# Altium schematic sheet FrameWork.SchDoc
size A4
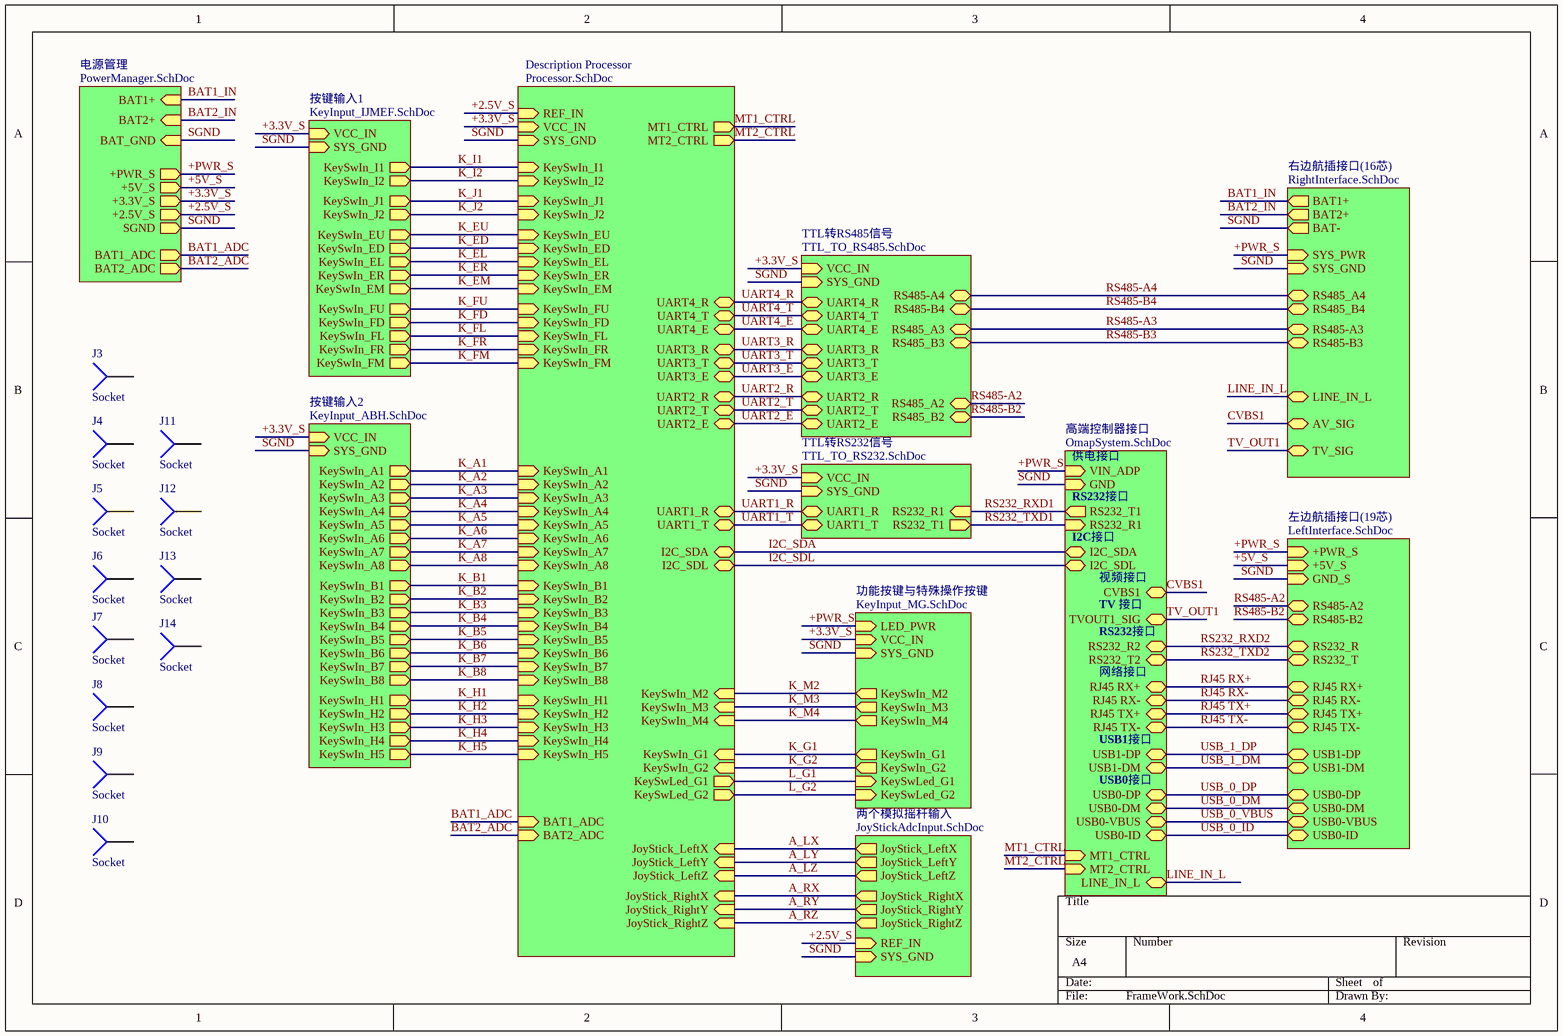
[diagram p0: FrameWork.SchDoc]

## Parts
J3  Socket  [HT-M3]
J4  Socket  [HT-M3]
J5  Socket  [HT-M3]
J6  Socket  [HT-M3]
J7  Socket  [HT-M3]
J8  Socket  [HT-M3]
J9  Socket  [HT-M3]
J10  Socket  [HT-M3]
J11  Socket  [HT-M3]
J12  Socket  [HT-M3]
J13  Socket  [HT-M3]
J14  Socket  [HT-M3]

## Sub-sheets
Description Processor = Processor.SchDoc: KeySwIn_I1 (in), KeySwIn_I2 (in), KeySwIn_J1 (in), KeySwIn_J2 (in), KeySwIn_EU (in), KeySwIn_ED (in), KeySwIn_EL (in), KeySwIn_ER (in), KeySwIn_EM (in), KeySwIn_FU (in), KeySwIn_FD (in), KeySwIn_FL (in), KeySwIn_FR (in), KeySwIn_FM (in), KeySwIn_A2 (in), KeySwIn_A3 (in), KeySwIn_A4 (in), KeySwIn_A5 (in), KeySwIn_A6 (in), KeySwIn_A7 (in), KeySwIn_A8 (in), KeySwIn_A1 (in), KeySwIn_B2 (in), KeySwIn_B3 (in), KeySwIn_B4 (in), KeySwIn_B5 (in), KeySwIn_B6 (in), KeySwIn_B7 (in), KeySwIn_B8 (in), KeySwIn_B1 (in), KeySwIn_H2 (in), KeySwIn_H3 (in), KeySwIn_H4 (in), KeySwIn_H5 (in), KeySwIn_H1 (in), KeySwIn_M3 (in), KeySwIn_M4 (in), KeySwIn_M2 (in), KeySwIn_G1 (in), KeySwIn_G2 (in), JoyStick_LeftX (in), JoyStick_LeftY (in), JoyStick_LeftZ (in), JoyStick_RightX (in), JoyStick_RightY (in), JoyStick_RightZ (in), KeySwLed_G1 (out), VCC_IN (in), SYS_GND (in), REF_IN (in), I2C_SDL (bidir), I2C_SDA (bidir), UART1_T (bidir), UART1_R (bidir), UART3_T (bidir), UART3_R (bidir), UART3_E (bidir), UART2_T (bidir), UART2_R (bidir), UART4_T (bidir), UART4_R (bidir), UART4_E (bidir), UART2_E (bidir), BAT2_ADC (in), BAT1_ADC (in), MT1_CTRL (out), MT2_CTRL (out), KeySwLed_G2 (out)
TTL转RS232信号 = TTL_TO_RS232.SchDoc: RS232_R1 (in), VCC_IN (in), SYS_GND (in), UART1_T (bidir), UART1_R (bidir), RS232_T1 (out)
TTL转RS485信号 = TTL_TO_RS485.SchDoc: VCC_IN (in), SYS_GND (in), UART3_T (bidir), UART3_R (bidir), RS485_B3 (bidir), RS485_A3 (bidir), RS485-B4 (bidir), RS485-A4 (bidir), UART3_E (bidir), UART2_T (bidir), UART2_R (bidir), UART4_T (bidir), UART4_R (bidir), UART4_E (bidir), UART2_E (bidir), RS485_B2 (bidir), RS485_A2 (bidir)
两个模拟摇杆输入 = JoyStickAdcInput.SchDoc: JoyStick_LeftX (out), JoyStick_LeftY (out), JoyStick_LeftZ (out), JoyStick_RightX (out), JoyStick_RightY (out), JoyStick_RightZ (out), REF_IN (in), SYS_GND (in)
功能按键与特殊操作按键 = KeyInput_MG.SchDoc: KeySwIn_M2 (out), KeySwIn_M3 (out), KeySwIn_M4 (out), KeySwIn_G2 (out), KeySwLed_G1 (in), KeySwIn_G1 (out), VCC_IN (in), SYS_GND (in), LED_PWR (in), KeySwLed_G2 (in)
右边航插接口(16芯) = RightInterface.SchDoc: RS485_B4 (bidir), RS485_A4 (bidir), BAT- (out), BAT1+ (out), SYS_GND (in), SYS_PWR (in), RS485-B3 (bidir), RS485-A3 (bidir), AV_SIG (bidir), TV_SIG (bidir), LINE_IN_L (bidir), BAT2+ (out)
左边航插接口(19芯) = LeftInterface.SchDoc: USB1-DP (bidir), USB1-DM (bidir), USB0-DP (bidir), USB0-DM (bidir), USB0-VBUS (bidir), USB0-ID (bidir), RS232_T (bidir), RS232_R (bidir), RS485-B2 (bidir), RS485-A2 (bidir), RJ45 RX+ (bidir), RJ45 TX+ (bidir), RJ45 RX- (bidir), RJ45 TX- (bidir), +PWR_S (in), +5V_S (in), GND_S (in)
按键输入1 = KeyInput_IJMEF.SchDoc: KeySwIn_I1 (out), KeySwIn_I2 (out), KeySwIn_J1 (out), KeySwIn_J2 (out), KeySwIn_EU (out), KeySwIn_ED (out), KeySwIn_EL (out), KeySwIn_ER (out), KeySwIn_EM (out), KeySwIn_FU (out), KeySwIn_FD (out), KeySwIn_FL (out), KeySwIn_FR (out), KeySwIn_FM (out), VCC_IN (in), SYS_GND (in)
按键输入2 = KeyInput_ABH.SchDoc: KeySwIn_A1 (out), KeySwIn_A2 (out), KeySwIn_A3 (out), KeySwIn_A4 (out), KeySwIn_A5 (out), KeySwIn_A6 (out), KeySwIn_A7 (out), KeySwIn_A8 (out), KeySwIn_B1 (out), KeySwIn_B2 (out), KeySwIn_B3 (out), KeySwIn_B4 (out), KeySwIn_B5 (out), KeySwIn_B6 (out), KeySwIn_B7 (out), KeySwIn_B8 (out), KeySwIn_H1 (out), KeySwIn_H2 (out), KeySwIn_H3 (out), KeySwIn_H4 (out), KeySwIn_H5 (out), VCC_IN (in), SYS_GND (in)
电源管理 = PowerManager.SchDoc: +PWR_S (out), +5V_S (out), +3.3V_S (out), +2.5V_S (out), BAT1+ (in), BAT2+ (in), SGND (out), BAT2_ADC (out), BAT1_ADC (out), BAT_GND (in)
高端控制器接口 = OmapSystem.SchDoc: VIN_ADP (in), GND (in), RJ45 RX+ (bidir), RJ45 TX+ (bidir), RJ45 RX- (bidir), RJ45 TX- (bidir), I2C_SDL (bidir), I2C_SDA (bidir), USB1-DP (bidir), USB1-DM (bidir), USB0-DP (bidir), USB0-DM (bidir), USB0-VBUS (bidir), USB0-ID (bidir), RS232_T2 (bidir), RS232_R2 (bidir), RS232_T1 (out), RS232_R1 (in), CVBS1 (bidir), TVOUT1_SIG (bidir), MT1_CTRL (in), MT2_CTRL (in), LINE_IN_L (bidir)

## Nets
+2.5V_S: sheet Description Processor/REF_IN, sheet 两个模拟摇杆输入/REF_IN, sheet 电源管理/+2.5V_S
+3.3V_S: sheet Description Processor/VCC_IN, sheet 按键输入1/VCC_IN, sheet 按键输入2/VCC_IN, sheet 功能按键与特殊操作按键/VCC_IN, sheet 电源管理/+3.3V_S, sheet TTL转RS232信号/VCC_IN, sheet TTL转RS485信号/VCC_IN
+5V_S: sheet 电源管理/+5V_S, sheet 左边航插接口(19芯)/+5V_S
+PWR_S: sheet 高端控制器接口/VIN_ADP, sheet 功能按键与特殊操作按键/LED_PWR, sheet 右边航插接口(16芯)/SYS_PWR, sheet 电源管理/+PWR_S, sheet 左边航插接口(19芯)/+PWR_S
A_LX: sheet Description Processor/JoyStick_LeftX, sheet 两个模拟摇杆输入/JoyStick_LeftX
A_LY: sheet Description Processor/JoyStick_LeftY, sheet 两个模拟摇杆输入/JoyStick_LeftY
A_LZ: sheet Description Processor/JoyStick_LeftZ, sheet 两个模拟摇杆输入/JoyStick_LeftZ
A_RX: sheet Description Processor/JoyStick_RightX, sheet 两个模拟摇杆输入/JoyStick_RightX
A_RY: sheet Description Processor/JoyStick_RightY, sheet 两个模拟摇杆输入/JoyStick_RightY
A_RZ: sheet Description Processor/JoyStick_RightZ, sheet 两个模拟摇杆输入/JoyStick_RightZ
BAT1_ADC: sheet Description Processor/BAT1_ADC, sheet 电源管理/BAT1_ADC
BAT1_IN: sheet 右边航插接口(16芯)/BAT1+, sheet 电源管理/BAT1+
BAT2_ADC: sheet Description Processor/BAT2_ADC, sheet 电源管理/BAT2_ADC
BAT2_IN: sheet 右边航插接口(16芯)/BAT2+, sheet 电源管理/BAT2+
CVBS1: sheet 高端控制器接口/CVBS1, sheet 右边航插接口(16芯)/AV_SIG
I2C_SDA: sheet Description Processor/I2C_SDA, sheet 高端控制器接口/I2C_SDA
I2C_SDL: sheet Description Processor/I2C_SDL, sheet 高端控制器接口/I2C_SDL
K_A1: sheet Description Processor/KeySwIn_A1, sheet 按键输入2/KeySwIn_A1
K_A2: sheet Description Processor/KeySwIn_A2, sheet 按键输入2/KeySwIn_A2
K_A3: sheet Description Processor/KeySwIn_A3, sheet 按键输入2/KeySwIn_A3
K_A4: sheet Description Processor/KeySwIn_A4, sheet 按键输入2/KeySwIn_A4
K_A5: sheet Description Processor/KeySwIn_A5, sheet 按键输入2/KeySwIn_A5
K_A6: sheet Description Processor/KeySwIn_A6, sheet 按键输入2/KeySwIn_A6
K_A7: sheet Description Processor/KeySwIn_A7, sheet 按键输入2/KeySwIn_A7
K_A8: sheet Description Processor/KeySwIn_A8, sheet 按键输入2/KeySwIn_A8
K_B1: sheet Description Processor/KeySwIn_B1, sheet 按键输入2/KeySwIn_B1
K_B2: sheet Description Processor/KeySwIn_B2, sheet 按键输入2/KeySwIn_B2
K_B3: sheet Description Processor/KeySwIn_B3, sheet 按键输入2/KeySwIn_B3
K_B4: sheet Description Processor/KeySwIn_B4, sheet 按键输入2/KeySwIn_B4
K_B5: sheet Description Processor/KeySwIn_B5, sheet 按键输入2/KeySwIn_B5
K_B6: sheet Description Processor/KeySwIn_B6, sheet 按键输入2/KeySwIn_B6
K_B7: sheet Description Processor/KeySwIn_B7, sheet 按键输入2/KeySwIn_B7
K_B8: sheet Description Processor/KeySwIn_B8, sheet 按键输入2/KeySwIn_B8
K_ED: sheet Description Processor/KeySwIn_ED, sheet 按键输入1/KeySwIn_ED
K_EL: sheet Description Processor/KeySwIn_EL, sheet 按键输入1/KeySwIn_EL
K_EM: sheet Description Processor/KeySwIn_EM, sheet 按键输入1/KeySwIn_EM
K_ER: sheet Description Processor/KeySwIn_ER, sheet 按键输入1/KeySwIn_ER
K_EU: sheet Description Processor/KeySwIn_EU, sheet 按键输入1/KeySwIn_EU
K_FD: sheet Description Processor/KeySwIn_FD, sheet 按键输入1/KeySwIn_FD
K_FL: sheet Description Processor/KeySwIn_FL, sheet 按键输入1/KeySwIn_FL
K_FM: sheet Description Processor/KeySwIn_FM, sheet 按键输入1/KeySwIn_FM
K_FR: sheet Description Processor/KeySwIn_FR, sheet 按键输入1/KeySwIn_FR
K_FU: sheet Description Processor/KeySwIn_FU, sheet 按键输入1/KeySwIn_FU
K_G1: sheet Description Processor/KeySwIn_G1, sheet 功能按键与特殊操作按键/KeySwIn_G1
K_G2: sheet Description Processor/KeySwIn_G2, sheet 功能按键与特殊操作按键/KeySwIn_G2
K_H1: sheet Description Processor/KeySwIn_H1, sheet 按键输入2/KeySwIn_H1
K_H2: sheet Description Processor/KeySwIn_H2, sheet 按键输入2/KeySwIn_H2
K_H3: sheet Description Processor/KeySwIn_H3, sheet 按键输入2/KeySwIn_H3
K_H4: sheet Description Processor/KeySwIn_H4, sheet 按键输入2/KeySwIn_H4
K_H5: sheet Description Processor/KeySwIn_H5, sheet 按键输入2/KeySwIn_H5
K_I1: sheet Description Processor/KeySwIn_I1, sheet 按键输入1/KeySwIn_I1
K_I2: sheet Description Processor/KeySwIn_I2, sheet 按键输入1/KeySwIn_I2
K_J1: sheet Description Processor/KeySwIn_J1, sheet 按键输入1/KeySwIn_J1
K_J2: sheet Description Processor/KeySwIn_J2, sheet 按键输入1/KeySwIn_J2
K_M2: sheet Description Processor/KeySwIn_M2, sheet 功能按键与特殊操作按键/KeySwIn_M2
K_M3: sheet Description Processor/KeySwIn_M3, sheet 功能按键与特殊操作按键/KeySwIn_M3
K_M4: sheet Description Processor/KeySwIn_M4, sheet 功能按键与特殊操作按键/KeySwIn_M4
L_G1: sheet Description Processor/KeySwLed_G1, sheet 功能按键与特殊操作按键/KeySwLed_G1
L_G2: sheet Description Processor/KeySwLed_G2, sheet 功能按键与特殊操作按键/KeySwLed_G2
LINE_IN_L: sheet 高端控制器接口/LINE_IN_L, sheet 右边航插接口(16芯)/LINE_IN_L
MT1_CTRL: sheet Description Processor/MT1_CTRL, sheet 高端控制器接口/MT1_CTRL
MT2_CTRL: sheet Description Processor/MT2_CTRL, sheet 高端控制器接口/MT2_CTRL
RJ45 RX+: sheet 高端控制器接口/RJ45 RX+, sheet 左边航插接口(19芯)/RJ45 RX+
RJ45 RX-: sheet 高端控制器接口/RJ45 RX-, sheet 左边航插接口(19芯)/RJ45 RX-
RJ45 TX+: sheet 高端控制器接口/RJ45 TX+, sheet 左边航插接口(19芯)/RJ45 TX+
RJ45 TX-: sheet 高端控制器接口/RJ45 TX-, sheet 左边航插接口(19芯)/RJ45 TX-
RS232_RXD1: sheet 高端控制器接口/RS232_T1, sheet TTL转RS232信号/RS232_R1
RS232_RXD2: sheet 高端控制器接口/RS232_R2, sheet 左边航插接口(19芯)/RS232_R
RS232_TXD1: sheet 高端控制器接口/RS232_R1, sheet TTL转RS232信号/RS232_T1
RS232_TXD2: sheet 高端控制器接口/RS232_T2, sheet 左边航插接口(19芯)/RS232_T
RS485-A2: sheet 左边航插接口(19芯)/RS485-A2, sheet TTL转RS485信号/RS485_A2
RS485-A3: sheet 右边航插接口(16芯)/RS485-A3, sheet TTL转RS485信号/RS485_A3
RS485-A4: sheet 右边航插接口(16芯)/RS485_A4, sheet TTL转RS485信号/RS485-A4
RS485-B2: sheet 左边航插接口(19芯)/RS485-B2, sheet TTL转RS485信号/RS485_B2
RS485-B3: sheet 右边航插接口(16芯)/RS485-B3, sheet TTL转RS485信号/RS485_B3
RS485-B4: sheet 右边航插接口(16芯)/RS485_B4, sheet TTL转RS485信号/RS485-B4
SGND: sheet Description Processor/SYS_GND, sheet 按键输入1/SYS_GND, sheet 两个模拟摇杆输入/SYS_GND, sheet 按键输入2/SYS_GND, sheet 高端控制器接口/GND, sheet 功能按键与特殊操作按键/SYS_GND, sheet 右边航插接口(16芯)/BAT-, sheet 右边航插接口(16芯)/SYS_GND, sheet 电源管理/SGND, sheet 电源管理/BAT_GND, sheet 左边航插接口(19芯)/GND_S, sheet TTL转RS232信号/SYS_GND, sheet TTL转RS485信号/SYS_GND
TV_OUT1: sheet 高端控制器接口/TVOUT1_SIG, sheet 右边航插接口(16芯)/TV_SIG
UART1_R: sheet Description Processor/UART1_R, sheet TTL转RS232信号/UART1_R
UART1_T: sheet Description Processor/UART1_T, sheet TTL转RS232信号/UART1_T
UART2_E: sheet Description Processor/UART2_E, sheet TTL转RS485信号/UART2_E
UART2_R: sheet Description Processor/UART2_R, sheet TTL转RS485信号/UART2_R
UART2_T: sheet Description Processor/UART2_T, sheet TTL转RS485信号/UART2_T
UART3_E: sheet Description Processor/UART3_E, sheet TTL转RS485信号/UART3_E
UART3_R: sheet Description Processor/UART3_R, sheet TTL转RS485信号/UART3_R
UART3_T: sheet Description Processor/UART3_T, sheet TTL转RS485信号/UART3_T
UART4_E: sheet Description Processor/UART4_E, sheet TTL转RS485信号/UART4_E
UART4_R: sheet Description Processor/UART4_R, sheet TTL转RS485信号/UART4_R
UART4_T: sheet Description Processor/UART4_T, sheet TTL转RS485信号/UART4_T
USB_0_DM: sheet 高端控制器接口/USB0-DM, sheet 左边航插接口(19芯)/USB0-DM
USB_0_DP: sheet 高端控制器接口/USB0-DP, sheet 左边航插接口(19芯)/USB0-DP
USB_0_ID: sheet 高端控制器接口/USB0-ID, sheet 左边航插接口(19芯)/USB0-ID
USB_0_VBUS: sheet 高端控制器接口/USB0-VBUS, sheet 左边航插接口(19芯)/USB0-VBUS
USB_1_DM: sheet 高端控制器接口/USB1-DM, sheet 左边航插接口(19芯)/USB1-DM
USB_1_DP: sheet 高端控制器接口/USB1-DP, sheet 左边航插接口(19芯)/USB1-DP

Not connected (* = marked no-connect by the designer): J3 1; J4 1; J5 1; J6 1; J7 1; J8 1; J9 1; J10 1; J11 1; J12 1; J13 1; J14 1

## Notes on the sheet
- 供电接口
- RS232接口
- I2C接口
- 视频接口
- TV 接口
- 网络接口
- USB1接口
- USB0接口

## Library data of the parts
J3-J14 = Socket: LatestRevisionDate: 17-Jul-2002; LatestRevisionNote: Re-released for DXP Platform.; Publisher: Altium Limited